# EAGLE design Groupe_5_Azzouz_Berger_Bilongo (EAGLE 8.3.1)
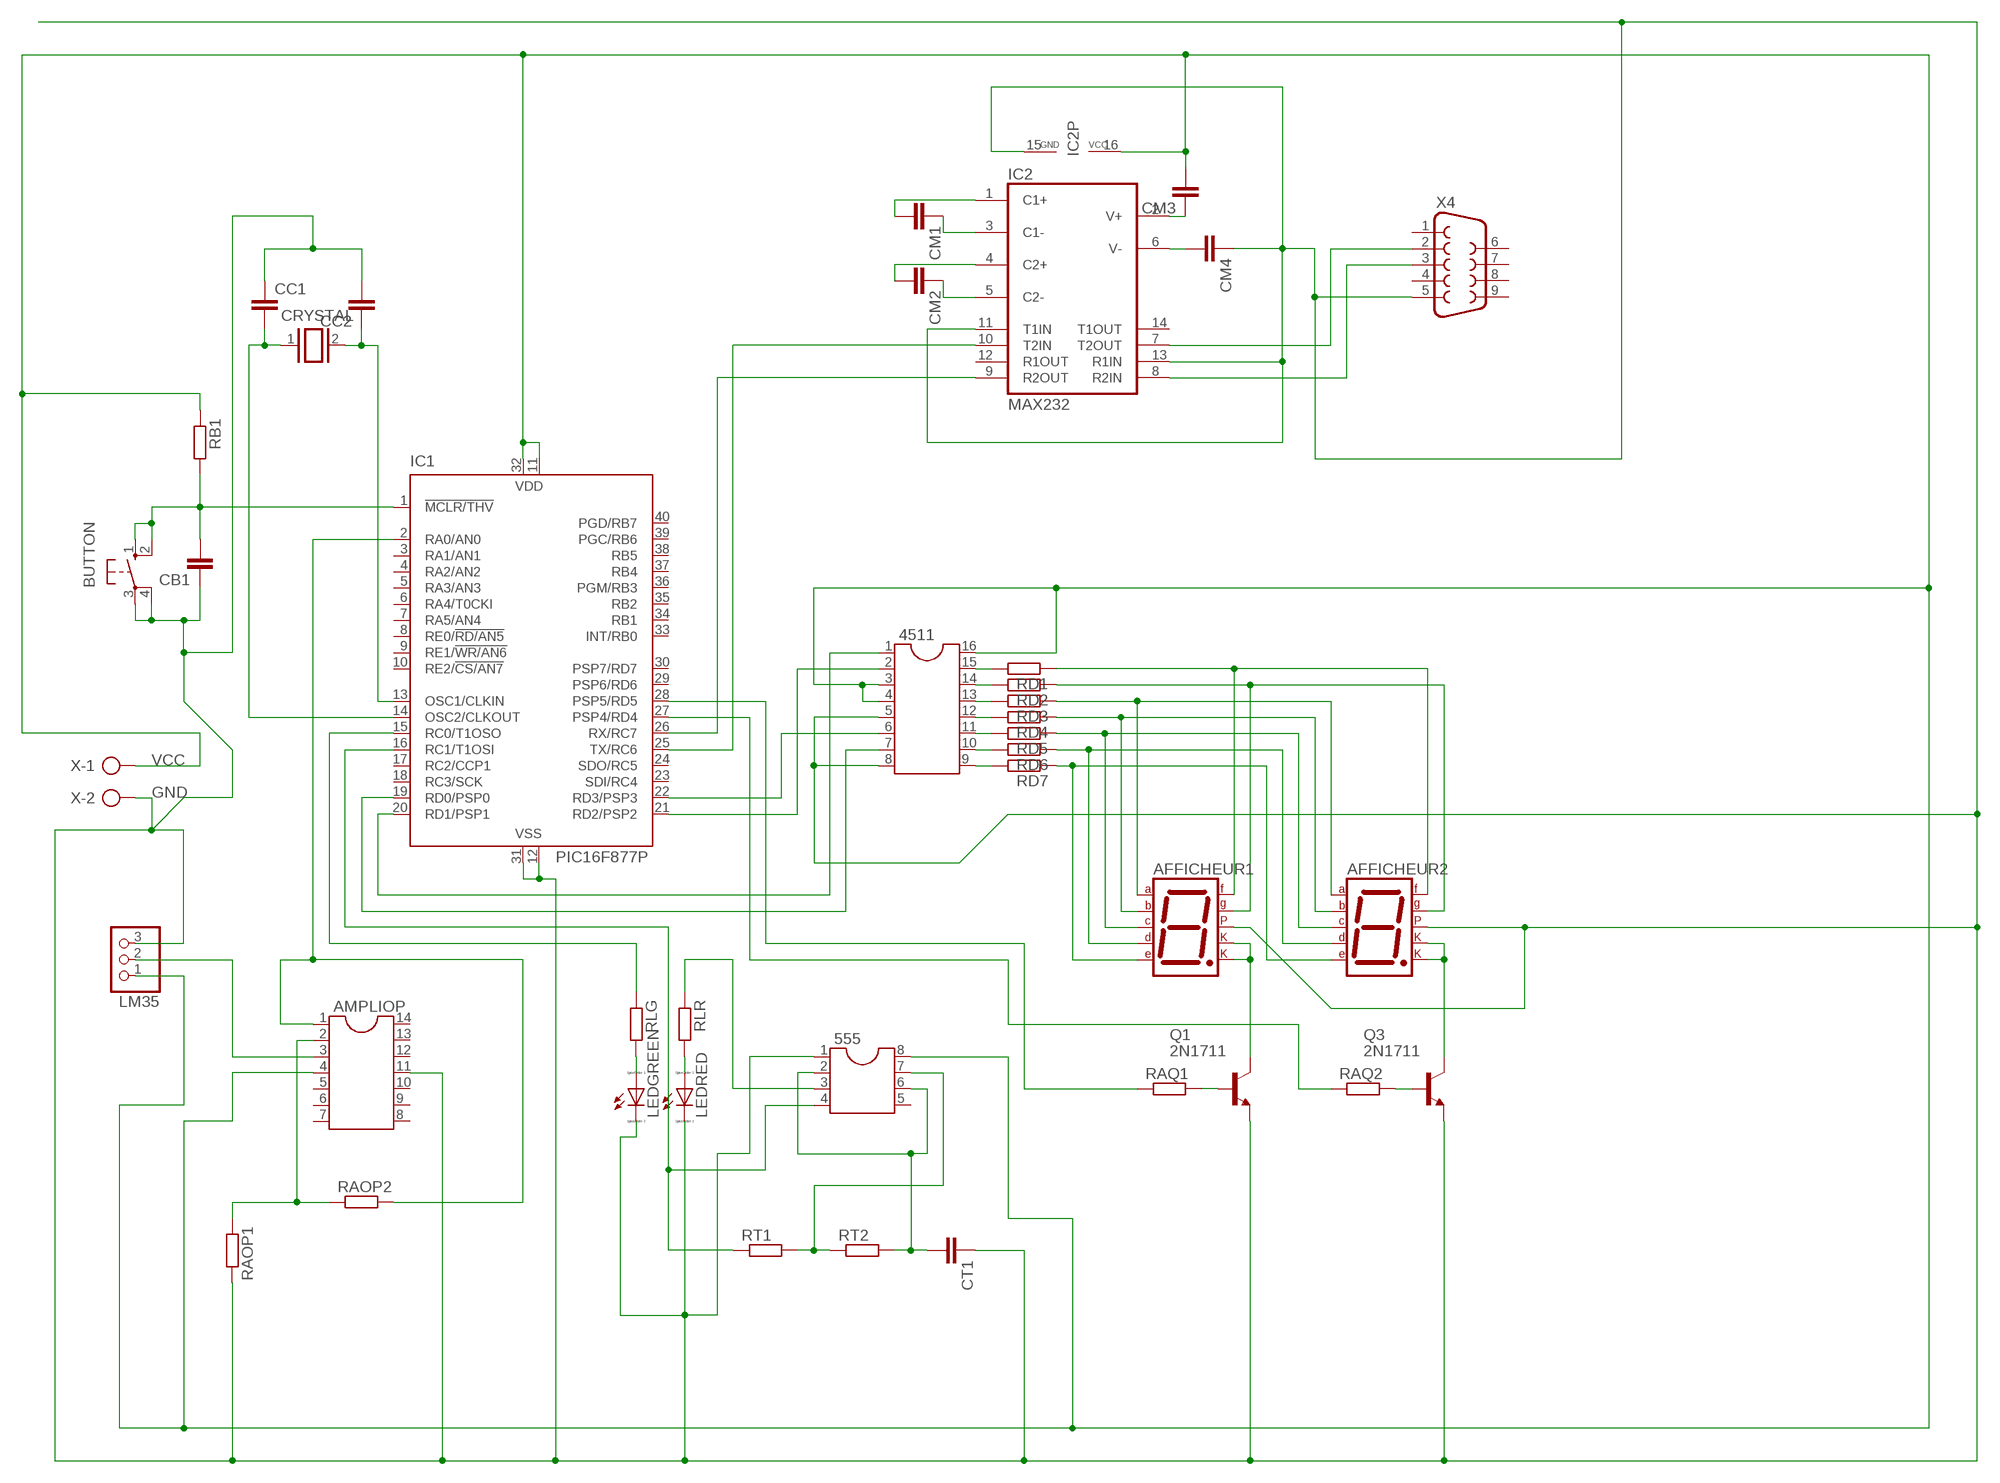
[diagram p0: schematic, sheet 1]

## Parts
555  DIL8  [DIL08]
4511  DIL16  [DIL16]
AFFICHEUR1  7SEG-CK  [7SEG-13]
AFFICHEUR2  7SEG-CK  [7SEG-13]
AMPLIOP  DIL14  [DIL14]
BUTTON  10-XX  [B3F-10XX]
CB1  C-EU025-050X050  [C025-050X050]
CC1  C-EU025-050X050  [C025-050X050]
CC2  C-EU025-050X050  [C025-050X050]
CM1  C-EU025-050X050  [C025-050X050]
CM2  C-EU025-050X050  [C025-050X050]
CM3  C-EU025-050X050  [C025-050X050]
CM4  C-EU025-050X050  [C025-050X050]
CRYSTAL  XTAL/S  [QS]
CT1  C-EU025-050X050  [C025-050X050]
IC1  PIC16F877P  [DIL40]
IC2  MAX232  [DIL16]
LEDGREEN  LED_ELD260  [LED_LD260]
LEDRED  LED_ELD260  [LED_LD260]
LM35  PINHD-1X3  [1X03]
Q1  2N1711  [TO39]
Q3  2N1711  [TO39]
RAOP1  R-EU_0204/7  [0204/7]
RAOP2  R-EU_0204/7  [0204/7]
RAQ1  R-EU_0204/7  [0204/7]
RAQ2  R-EU_0204/7  [0204/7]
RB1  R-EU_0204/7  [0204/7]
RD1  R-EU_0204/7  [0204/7]
RD2  R-EU_0204/7  [0204/7]
RD3  R-EU_0204/7  [0204/7]
RD4  R-EU_0204/7  [0204/7]
RD5  R-EU_0204/7  [0204/7]
RD6  R-EU_0204/7  [0204/7]
RD7  R-EU_0204/7  [0204/7]
RLG  R-EU_0204/7  [0204/7]
RLR  R-EU_0204/7  [0204/7]
RT1  R-EU_0204/7  [0204/7]
RT2  R-EU_0204/7  [0204/7]
X  AK300/2  [AK300/2]
X4  F09V  [F09V]

## Nets
GND: 555.1 4511.5 4511.8 AFFICHEUR1.5(DP) AFFICHEUR2.5(DP) AMPLIOP.11 BUTTON.3(P) BUTTON.4(P1) CB1.1 CC1.1 CC2.2 CM4.1 CT1.1 IC1.12(VSS) IC1.31(VSS) IC2.11(T1IN) IC2.13(R1IN) IC2.15(GND) LEDGREEN.K(C) LEDRED.K(C) LM35.3 Q1.1(E) Q3.1(E) RAOP1.2 X4.5 X.2
N$1: IC1.15(RC0/T1OSO) RLG.1
N$2: LEDGREEN.A RLG.2
N$3: BUTTON.1(S) BUTTON.2(S1) CB1.2 IC1.1(!MCLR/THV) RB1.2
N$4: 555.3 RLR.1
N$5: CC1.2 CRYSTAL.1 IC1.14(OSC2/CLKOUT)
N$6: CC2.1 CRYSTAL.2 IC1.13(OSC1/CLKIN)
N$7: LEDRED.A RLR.2
N$8: AMPLIOP.3 LM35.2
N$9: AMPLIOP.2 RAOP1.1 RAOP2.1
N$10: AMPLIOP.1 IC1.2(RA0/AN0) RAOP2.2
N$11: 555.2 555.6 CT1.2 RT2.2
N$12: 555.7 RT1.2 RT2.1
N$13: 555.4 IC1.16(RC1/T1OSI) RT1.1
N$14: 4511.6 IC1.22(RD3/PSP3)
N$15: 4511.2 IC1.21(RD2/PSP2)
N$16: 4511.15 RD1.2
N$17: 4511.7 IC1.19(RD0/PSP0)
N$18: 4511.1 IC1.20(RD1/PSP1)
N$19: 4511.14 RD2.2
N$20: 4511.13 RD3.2
N$21: 4511.12 RD4.2
N$22: 4511.11 RD5.2
N$23: 4511.10 RD6.2
N$24: 4511.9 RD7.2
N$25: AFFICHEUR1.3(CK1) AFFICHEUR1.8(CK2) Q1.3(C)
N$26: AFFICHEUR2.3(CK1) AFFICHEUR2.8(CK2) Q3.3(C)
N$27: AFFICHEUR1.1(E) AFFICHEUR2.1(E) RD7.1
N$28: AFFICHEUR1.2(D) AFFICHEUR2.2(D) RD6.1
N$29: AFFICHEUR1.4(C) AFFICHEUR2.4(C) RD5.1
N$30: AFFICHEUR1.6(B) AFFICHEUR2.6(B) RD4.1
N$31: AFFICHEUR1.7(A) AFFICHEUR2.7(A) RD3.1
N$32: AFFICHEUR1.10(G) AFFICHEUR2.10(G) RD2.1
N$33: AFFICHEUR1.9(F) AFFICHEUR2.9(F) RD1.1
N$34: Q1.2(B) RAQ1.2
N$35: Q3.2(B) RAQ2.2
N$36: IC1.28(PSP5/RD5) RAQ1.1
N$37: IC1.27(PSP4/RD4) RAQ2.1
N$38: CM3.1 IC2.2(V+)
N$39: CM1.2 IC2.1(C1+)
N$40: CM1.1 IC2.3(C1-)
N$41: CM2.2 IC2.4(C2+)
N$42: CM2.1 IC2.5(C2-)
N$43: CM4.2 IC2.6(V-)
N$44: IC1.25(TX/RC6) IC2.10(T2IN)
N$45: IC1.26(RX/RC7) IC2.9(R2OUT)
N$46: IC2.8(R2IN) X4.3
N$48: IC2.7(T2OUT) X4.2
VCC: 555.8 4511.3 4511.4 4511.16 AMPLIOP.4 CM3.2 IC1.11(VDD) IC1.32(VDD) IC2.16(VCC) LM35.1 RB1.1 X.1
Unconnected: 555.5 AMPLIOP.5 AMPLIOP.6 AMPLIOP.7 AMPLIOP.8 AMPLIOP.9 AMPLIOP.10 AMPLIOP.12 AMPLIOP.13 AMPLIOP.14 IC1.3(RA1/AN1) IC1.4(RA2/AN2) IC1.5(RA3/AN3) IC1.6(RA4/T0CKI) IC1.7(RA5/AN4) IC1.8(RE0/!RD/AN5) IC1.9(RE1/!WR/AN6) IC1.10(RE2/!CS/AN7) IC1.17(RC2/CCP1) IC1.18(RC3/SCK) IC1.23(SDI/RC4) IC1.24(SDO/RC5) IC1.29(PSP6/RD6) IC1.30(PSP7/RD7) IC1.33(INT/RB0) IC1.34(RB1) IC1.35(RB2) IC1.36(PGM/RB3) IC1.37(RB4) IC1.38(RB5) IC1.39(PGC/RB6) IC1.40(PGD/RB7) IC2.12(R1OUT) IC2.14(T1OUT) X4.1 X4.4 X4.6 X4.7 X4.8 X4.9

## Library data of the parts
555 = ic-package:DIL8: Dual In Line / Socket
4511 = ic-package:DIL16: Dual In Line / Socket
AFFICHEUR1 AFFICHEUR2 = special:7SEG-CK: 7-segment DISPLAY single cathode, 13 mm
AMPLIOP = ic-package:DIL14: Dual In Line / Socket
BUTTON = switch-omron:10-XX: OMRON SWITCH; MPN: B3F-1000; OC_FARNELL: 176432; OC_NEWARK: 36M3542
CB1 CC1 CC2 CM1-CM4 CT1 = rcl:C-EU: CAPACITOR, European symbol
CRYSTAL = special:XTAL/S: CRYSTAL
IC1 = microchip:PIC16F87*: MICROCONTROLLER; MF: MICROCHIP; MPN: PIC16F877-04/P; OC_FARNELL: 9761349; OC_NEWARK: 61K3463
IC2 = maxim:MAX232: RS232 TRANSCEIVER; MF: MAXIM; MPN: MAX232ACPE+; OC_FARNELL: 9723773; OC_NEWARK: 68K4544
LEDGREEN LEDRED = eagle-ltspice:LED_E: LED Source: http://www.osram.convergy.de Source: www.luxeon.com Source: www.kingbright.com; SPICEMODEL: NONE; SPICEPREFIX: D; SPICETYPE: diode
LM35 = pinhead:PINHD-1X3: PIN HEADER
Q1 Q3 = transistor-npn:2N1711: NPN Transistor
RAOP1 RAOP2 RAQ1 RAQ2 RB1 RD1-RD7 RLG RLR RT1 RT2 = rcl:R-EU_: RESISTOR, European symbol
X = con-ptr500:AK300/2: CONNECTOR; OC_FARNELL: unknown; OC_NEWARK: unknown
X4 = con-subd:F09: SUB-D; OC_FARNELL: unknown; OC_NEWARK: unknown

## Board
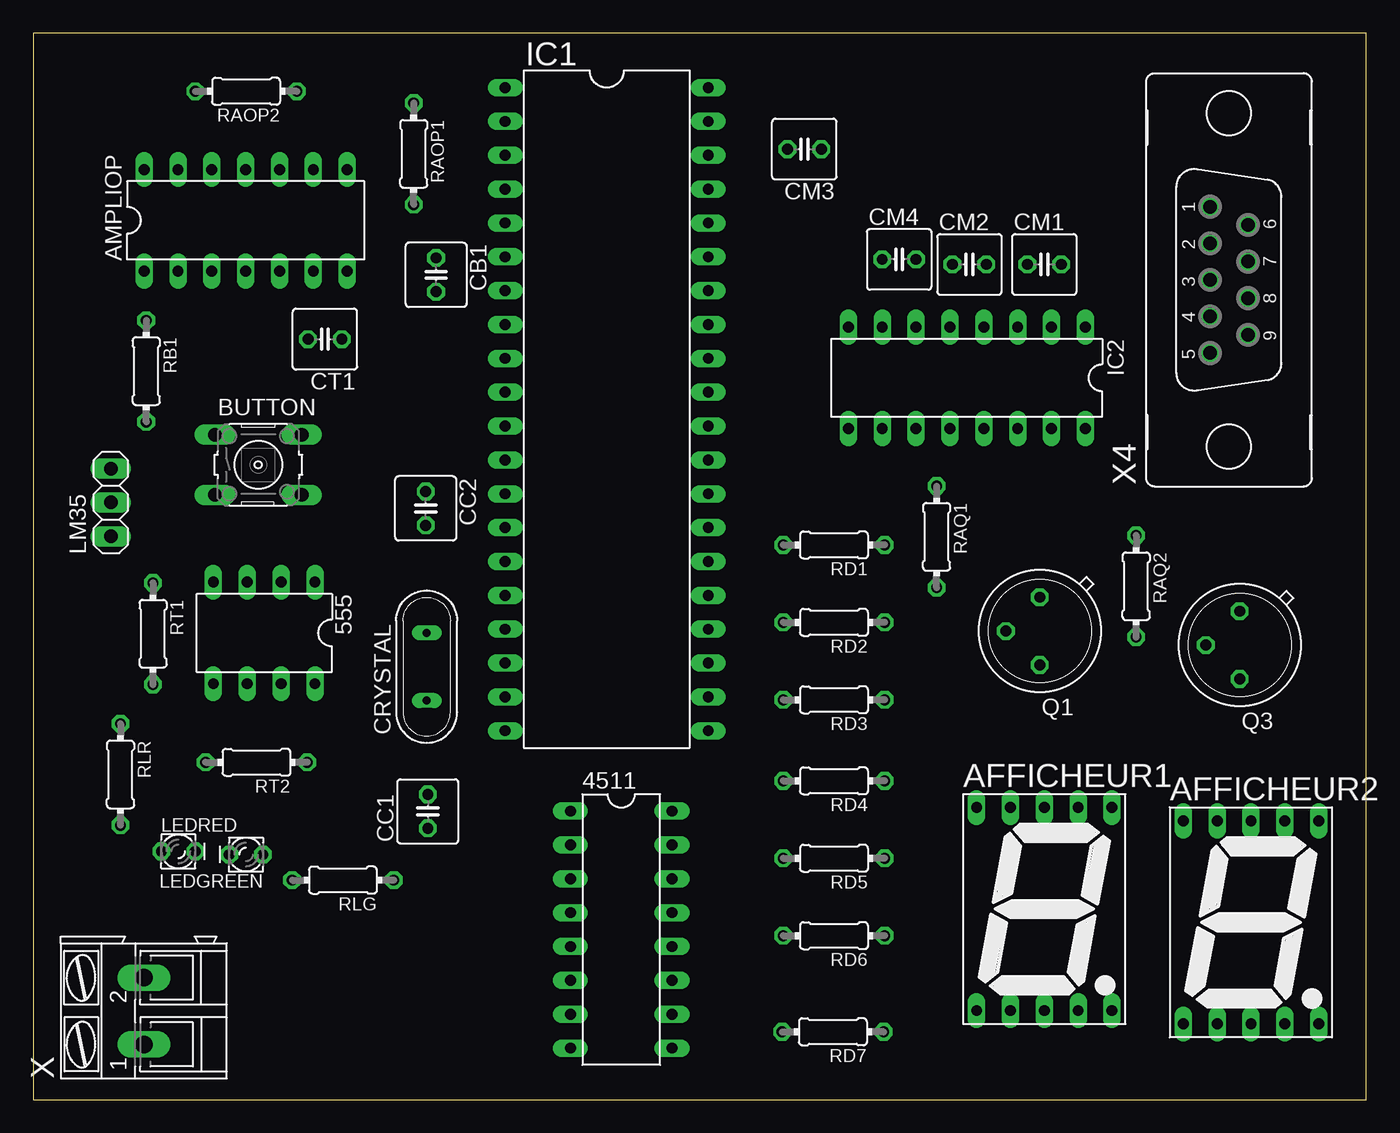
[diagram p1: board, top side]
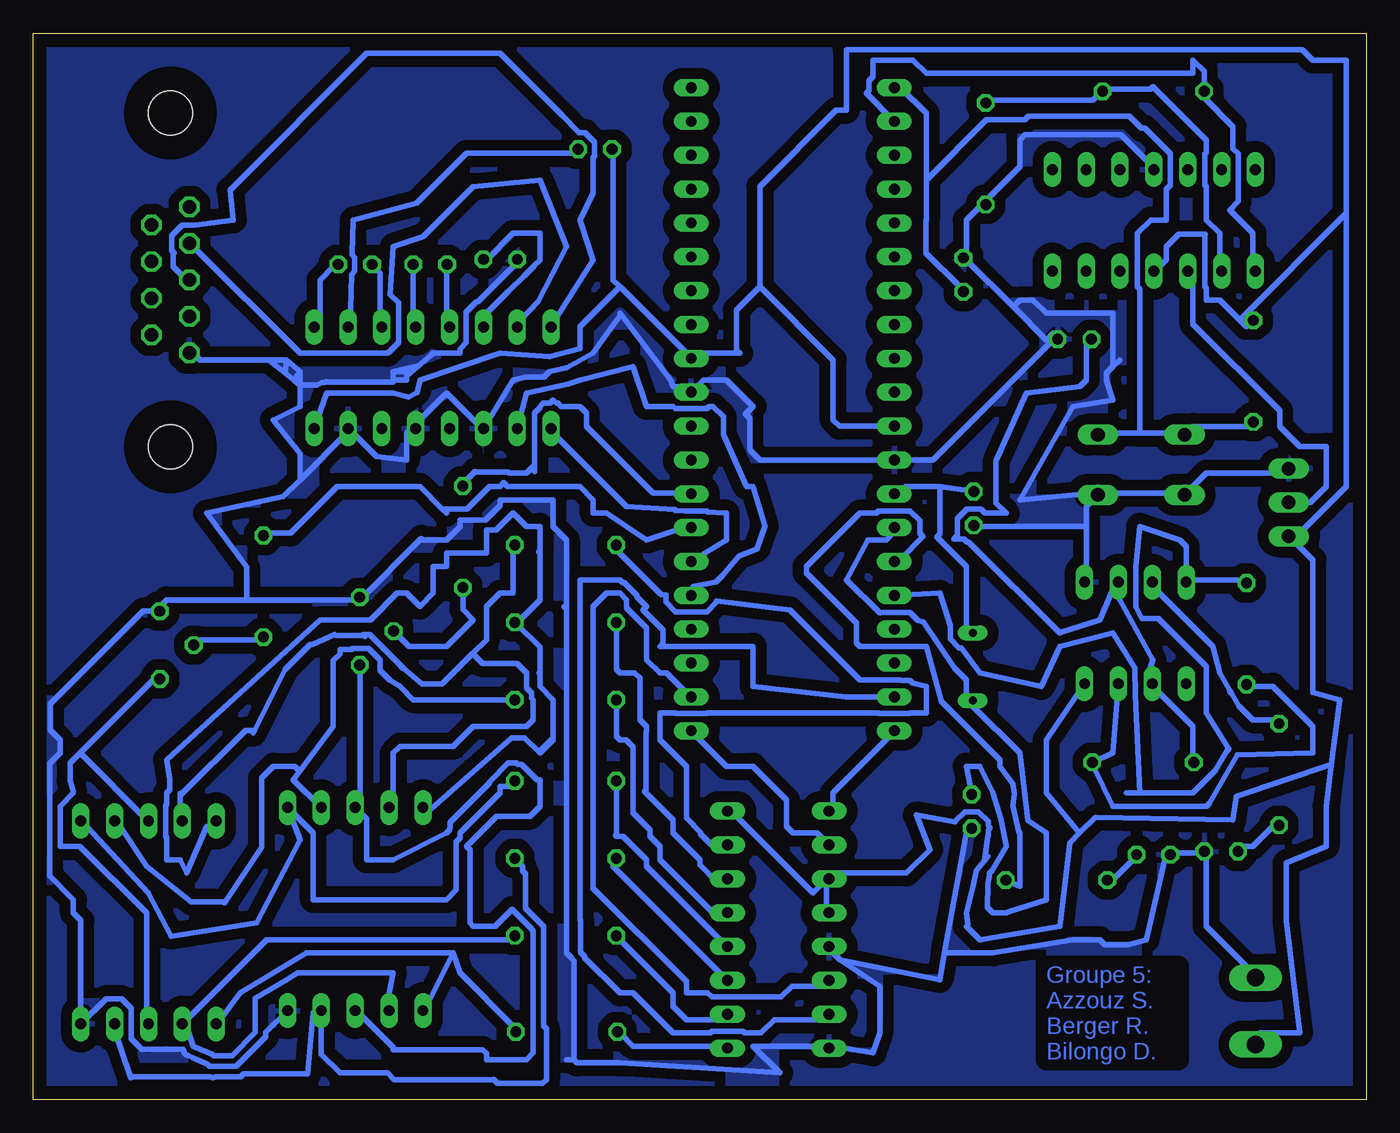
[diagram p2: board, bottom side, seen from below]

Size 100 x 80 mm. Coordinates in mm from the lower left corner, seen from the top.
Outline: 0,0 100,0 100,80 0,80 0,0
Copper layers (1*16): Top 0.035mm / dielectric 1.5mm / Bottom 0.035mm
Design rules "default *": minimum track width 15mil, minimum drill 0.35mm, track to track 15mil, track to pad 15mil, pad to pad 15mil, via to via 15mil, smd to smd 15mil, copper to edge 40mil, drill to drill 6mil, minimum pad ring 10mil, minimum via ring 8mil, stop-mask expansion 4mil, vias tented up to drill 0mil, thermal gap 10mil

### Footprints (pad centres in the part's own frame; a part is rotated, then mirrored left to right if it is on the bottom)
DIL08 = drill 0.813 long: 1 -3.81,-3.81; 2 -1.27,-3.81; 3 1.27,-3.81; 4 3.81,-3.81; 5 3.81,3.81; 6 1.27,3.81; 7 -1.27,3.81; 8 -3.81,3.81
DIL16 = drill 0.813 long: 1 -8.89,-3.81; 2 -6.35,-3.81; 3 -3.81,-3.81; 4 -1.27,-3.81; 5 1.27,-3.81; 6 3.81,-3.81; 7 6.35,-3.81; 8 8.89,-3.81; 9 8.89,3.81; 10 6.35,3.81; 11 3.81,3.81; 12 1.27,3.81; 13 -1.27,3.81; 14 -3.81,3.81; 15 -6.35,3.81; 16 -8.89,3.81
7SEG-13 = drill 0.813 long: 1 -5.08,-7.62; 2 -2.54,-7.62; 3 0,-7.62; 4 2.54,-7.62; 5 5.08,-7.62; 6 5.08,7.62; 7 2.54,7.62; 8 0,7.62; 9 -2.54,7.62; 10 -5.08,7.62
DIL14 = drill 0.813 long: 1 -7.62,-3.81; 2 -5.08,-3.81; 3 -2.54,-3.81; 4 0,-3.81; 5 2.54,-3.81; 6 5.08,-3.81; 7 7.62,-3.81; 8 7.62,3.81; 9 5.08,3.81; 10 2.54,3.81; 11 0,3.81; 12 -2.54,3.81; 13 -5.08,3.81; 14 -7.62,3.81
B3F-10XX = drill 1.016 long: 1 -3.251,2.261; 2 3.251,2.261; 3 -3.251,-2.261; 4 3.251,-2.261
C025-050X050 = drill 0.813 octagon: 1 -1.27,0; 2 1.27,0
QS = drill 0.61 long: 1 -2.54,0; 2 2.54,0
DIL40 = drill 0.813 long: 1 -24.13,-7.62; 2 -21.59,-7.62; 3 -19.05,-7.62; 4 -16.51,-7.62; 5 -13.97,-7.62; 6 -11.43,-7.62; 7 -8.89,-7.62; 8 -6.35,-7.62; 9 -3.81,-7.62; 10 -1.27,-7.62; 11 1.27,-7.62; 12 3.81,-7.62; 13 6.35,-7.62; 14 8.89,-7.62; 15 11.43,-7.62; 16 13.97,-7.62; 17 16.51,-7.62; 18 19.05,-7.62; 19 21.59,-7.62; 20 24.13,-7.62; 21 24.13,7.62; 22 21.59,7.62; 23 19.05,7.62; 24 16.51,7.62; 25 13.97,7.62; 26 11.43,7.62; 27 8.89,7.62; 28 6.35,7.62; 29 3.81,7.62; 30 1.27,7.62; 31 -1.27,7.62; 32 -3.81,7.62; 33 -6.35,7.62; 34 -8.89,7.62; 35 -11.43,7.62; 36 -13.97,7.62; 37 -16.51,7.62; 38 -19.05,7.62; 39 -21.59,7.62; 40 -24.13,7.62
LED_LD260 = drill 0.813 octagon: A -1.27,0; K 1.27,0
1X03 = drill 1.016 long: 1 -2.54,0; 2 0,0; 3 2.54,0
TO39 = drill 0.813 octagon: 1 0,-2.54; 2 2.54,0; 3 0,2.54
0204/7 = drill 0.813 octagon: 1 -3.81,0; 2 3.81,0
AK300/2 = drill 1.321 long: 1 -2.515,0; 2 2.489,0
F09V = drill 1.016 octagon: 1 5.486,1.422; 2 2.743,1.422; 3 0,1.422; 4 -2.743,1.422; 5 -5.486,1.422; 6 4.115,-1.422; 7 1.372,-1.422; 8 -1.372,-1.422; 9 -4.115,-1.422 | hole 3.302: -12.522,0; 12.522,0

### Placement (x,y rotation side)
555  17.32,35.01 180 top
4511  44.11,12.75 270 top
AFFICHEUR1  75.85,14.29 0 top
AFFICHEUR2  91.36,13.29 0 top
AMPLIOP  15.93,65.97 0 top
BUTTON  16.88,47.62 0 top
CB1  30.22,61.88 270 top
CC1  29.6,21.62 90 top
CC2  29.44,44.35 270 top
CM1  75.85,62.66 0 top
CM2  70.23,62.66 0 top
CM3  57.85,71.31 180 top
CM4  64.96,63.04 0 top
CRYSTAL  29.51,32.48 90 top
CT1  21.88,57.05 180 top
IC1  43.02,51.8 270 top
IC2  70.04,54.15 180 top
LEDGREEN  15.96,18.38 180 top
LEDRED  10.88,18.62 0 top
LM35  5.81,44.8 90 top
Q1  75.51,35.15 180 top
Q3  90.51,34.1 180 top
RAOP1  28.54,70.96 270 top
RAOP2  15.96,75.65 180 top
RAQ1  67.77,42.22 270 top
RAQ2  82.74,38.51 270 top
RB1  8.47,54.65 270 top
RD1  60.07,41.61 180 top
RD2  60.07,35.8 180 top
RD3  60.07,29.99 180 top
RD4  60.07,23.91 180 top
RD5  60.07,18.1 180 top
RD6  60.07,12.29 180 top
RD7  59.99,5.08 180 top
RLG  23.23,16.46 180 top
RLR  6.54,24.39 270 top
RT1  8.98,34.95 270 top
RT2  16.74,25.3 180 top
X  8.29,6.65 90 top
X4  89.71,61.5 90 top

### Tracks (layer width: path | path; a pad name or v marks a point on that pad's centre or on a via)
GND
  Bottom 0.406: 21,43 21,44.5 20.5,45 BUTTON.4 | 21,43 21,39 555.1 | 21,43 29,43 CC2.2 | BUTTON.4 20,45.5 14,45.5 BUTTON.3 13.5,45.5 12,47 6,47 LM35.3 | 26.49,59.49 24,57 23.5,57.5 CT1.1 23.5,57 32.5,48 35,48 IC1.12 35.5,48 45.5,48 46.25,48.75 46.25,51.1 46.57,51.43 46,52 48,54 49.71,54 IC1.31 51,53.5 52,53.5 52.15,53.95 56,59 56,58.83 58,56 59.96,54.92 61.26,54.62 61.67,54.21 63.07,54.21 64,54 IC2.11 66.5,50.5 69,53 71.5,50.5 | 26.49,59.49 30,63 CB1.1 30,63.5 30,66 29,67 RAOP1.2 28.5,67.5 26,70 26,72 25.6,72.4 18.4,72.4 15.93,69.93 AMPLIOP.11 | 18.5,55.5 19,55 | 19,55 19.5,54.5 19.5,54 19,52.5 22,52 26,45 20.5,45.5 BUTTON.4 | X.2 8.5,9.5 12,13 12,18.5 LEDRED.K 12.5,18.5 14.5,18.5 LEDGREEN.K 15,18.5 16.5,12 17.9,11.62 19.62,11.62 20,12 22,12 28,11 31.57,11 31.63,11.06 | 39.5,10.5 40,11 4511.5 | 39.5,10.5 36.5,8.5 36.5,5 37,3.5 40,4 4511.8 40.5,4 46,4 44,2 56.02,2.75 59.21,2.75 59.42,2.96 | 39.5,10.5 32,9 31.63,11.06 | 31.63,11.06 30,20 CC1.1 | 82.34,55.5 87.5,55.5 88,56 X4.5 | CM4.1 64,63 64,62.5 66.64,59.87 66.75,59.87 67.53,59.09 67.53,56.78 68,56.31 68,56 70,56 70.15,55.87 72,54.26 | 84,37.5 90,37.5 90.5,37 Q3.1 91.77,36.64 98.72,29.69 98.72,27.72 98,27 98,26 98.78,25.22 98.78,16.78 97,15 97,14 96.44,13.44 AFFICHEUR2.5 94.53,7.58 93.38,7.58 92.66,6.85 92.66,4.54 91.88,3.77 88.77,3.77 88.64,3.44 88.62,3.43 88.62,3.41 88.33,3.29 88.06,3.15 86.93,2.65 86.79,2.51 86.57,2.51 86.53,2.49 86.47,2.51 84.77,2.51 82.57,4.71 82.57,5.03 AFFICHEUR1.5 | 84,37.5 76,37.5 Q1.1 75.5,37.5 70.91,42.09 70.81,42 69,42 68,43 68,43.5 66.09,43.5 65,44.59 65,45 61,45 61,43 60,42 60,37 60.18,37 60,36.82 60,11 59.73,10.73
  Bottom 0.406: 71.5,50.5 72,50 72,48 74.25,48.25 76,50 IC2.15 76.5,50 80,46.5 | 71.5,50.5 IC2.13 | 84,37.5 84,39.95 87,44 81.25,45.25 80,46.5 | 80,46.5 80,48.47 82,51 80,52 80,53.61 | 80,53.61 80,54.63 | 60,3 59.42,2.96 | 19,55 19,59 24,59 25,60 25.97,60 26.49,59.49 | 72,54.26 72,54.63 73,54.63 | 72,54.26 72,54 73,54 | 73,54 73,53.81 73.12,53.84 78.03,53.84 78.05,53.85 78.18,53.79 78.33,53.79 78.69,53.61 80,53.61 | 80.15,53.74 80.46,53.98 | 80.15,53.74 80,53.61 | 80.77,54.23 80.46,53.98 | 80.77,54.23 82.34,55.5 | 80,54.63 80.46,53.98 | 82.34,55.5 81,55.5 | 81,55.5 80,54.63 | 81,55.5 81.12,54.51 80.77,54.23 | 80,54.63 80.15,53.74 | 73,54.63 73,54 | 71.06,55.08 73,54.63 | 59.42,2.96 59.42,10.42 59.73,10.73 | 59.63,10.63 59.73,10.73 | 59.73,10.73 | 59.73,10.73 59.74,10.74
  pour Bottom (isolate 0.813, rank 2): 0,0 0,80 100,80 100,0
N$1
  Bottom 0.406: 27.12,16.5 RLG.1 26,16 26,20 26.04,20.06 26.5,22.05 26.41,22.95 26.5,23.67 27.5,25 27.5,25.5 31.88,29.88 33,34 38,34 38.25,34.25 38.25,35.75 42,39.5 42,40 38,44 36.73,44 36.58,44.16 34.22,44.16 33.49,43.43 33.49,42.48 33.26,42.24 35,40.5 IC1.15
N$2
  Bottom 0.406: LEDGREEN.A 17.5,18 19,16.5 RLG.2
N$3
  Bottom 0.406: RB1.2 8.5,50.5 13,50.5 13.5,50 BUTTON.1 14,50 17,50 | 17,50 20,50 BUTTON.2 | CB1.2 30.5,61 33.01,63.51 33.01,65.99 33,66 33,69 | 35,75.5 IC1.1 34.93,75.93 33,74 33,69 | 17,50 17,60.81 17.18,60.98 17.18,65 16.18,66 15,66 15,68.29 14.69,68.6 14.69,70.96 16.59,72.87 16.87,72.87 17.79,73.79 25.33,73.79 25.61,73.5 28.5,73.5 33,69
N$4
  Bottom 0.406: RLR.1 7,28.5 8.5,28.5 9.54,29.54 10.12,30.52 10.22,30.62 10.22,30.69 11,32 11.5,34 16,38.5 555.3
N$5
  Bottom 0.406: IC1.14 35.5,42.5 36,42 37.39,42 39,39 36.5,36.5 36.21,36.56 36.11,36.53 34.22,36.53 33.64,35.95 33.22,35.85 30.88,32.38 30,31.5 30,30 CRYSTAL.1 29.5,29.5 26,26 25.37,20.95 24,20 24,15 26.73,14.14 27,14 28,14 28.43,14.43 28.4,16.2 28.35,16.42 28.29,16.78 28.29,16.98 28.09,17.17 27,19 27.39,21.04 | 27.39,21.04 | 27.39,21.04 28,23 29,25 30,25 CC1.2
N$6
  Bottom 0.406: CRYSTAL.2 30,35.5 30,40 32.21,42.21 32,42.42 32,46 | 35.28,45.31 35,45 | 35.28,45.31 IC1.13 | 32,46 29.63,45.65 CC2.1 | 32,46 34.59,46 35.28,45.31
N$7
  Bottom 0.406: LEDRED.A 9.5,19 8.5,19 7,20.5 RLR.2
N$8
  Bottom 0.406: AMPLIOP.3 13,62 13,58.19 6.5,51.69 6.5,50.5 5,49 3,49 3,46 4.2,44.8 LM35.2
N$9
  Bottom 0.406: AMPLIOP.2 11,62.5 11,65 12,66 12,68.51 12.1,68.6 12.1,70.96 12,71.05 12,72 16,76 16.21,75.79 19.66,75.79 RAOP2.1 20,75.5 20.5,75 28.5,75 RAOP1.1
N$10
  Bottom 0.406: AMPLIOP.1 8.5,62.5 8.5,65 10.25,66.75 9.61,67.39 9.61,70.96 10,71.35 10,73 12.15,75.15 RAOP2.2 12.15,77.14 13,77.99 13,77 33,77 33.99,77.99 37,77.99 37,76.75 37.3,76.45 37.3,75.69 37.5,75.5 35.5,73.5 IC1.2
N$11
  Bottom 0.406: RT2.2 13,25.5 13,28 16,31 555.6 16.5,31.5 16,33 18.5,37.5 555.2 18.75,38.89 20,36 22.95,35.05 23,35 29.84,41.84 29.96,41.84 30.18,42.06 30.94,42.06 30.68,42.31 30.68,43.6 29.96,44.33 28.92,44.33 28.6,44 27,44 27.77,44.77 27.77,47.9 25.5,53 21.5,53.5 21,54 21,57 CT1.2
N$12
  Bottom 0.406: RT1.2 8.5,31 7,31 4,28 4,26 9.67,25.85 11.77,22.23 12,22 19,22 20.52,25.09 RT2.1 19,26 555.7
N$13
  Bottom 0.406: 9,38.88 RT1.1 9,39 13.5,39 555.4 | 13.5,38.88 555.4 | 17,23 17.3,30.3 17.34,32.37 17.34,32.38 17.35,32.38 19,35 23,34 24.38,30.98 29,32 30.38,33.88 30.54,33.88 31.21,34.55 31.21,35.49 31.18,35.53 32,38 IC1.16 | 17,23 13,23 11.32,24.68 10.46,26.16 10.32,26.3 12,29 12,32.5 15.6,36.1 16.82,36.1 17.3,36.95 17.3,40 17.29,40 17.29,40.03 17,43 14,42 13.51,41.51 555.4 | 17,23 18,23
N$14
  Bottom 0.406: 4511.6 40.5,8.5 43.09,8.5 43.89,7.7 49.1,7.7 49.4,8 51,8 51,8.85 58,15.85 58,37 57,38 56,38 55.5,37.5 55.5,36.89 54,35.39 54,33 53,32 52.5,32 51,30.5 IC1.22
N$15
  Bottom 0.406: IC1.21 50.64,27.64 48,25 46,25 43.5,22.5 43.5,20.5 43,20 41.2,20 4511.2
N$16
  Bottom 0.406: RD1.2 56.5,41.5 52.9,37.9 52.55,37.85 52.55,37.31 51.82,36.59 49.46,36.59 48.73,37.31 48.73,37.4 43.25,36.75 38,31.5 35,31.5 34.82,31.45 34.22,31.45 34.03,31.26 33,31 33,29 34.19,29 34.22,28.96 36.58,28.96 36.61,29 49.43,29 49.46,28.96 51.82,28.96 51.85,29 53,29 53,27 51,25 51,21.11 49.94,20.06 49.94,19.94 49,19 48.02,19 4511.15
N$17
  Bottom 0.406: 4511.7 40.5,6 44.39,6 45.39,5 46.64,5 46.74,5.11 49.1,5.11 49.2,5 52,5 55,8 56,8 58.64,10.64 58.64,10.75 58.94,11.06 58.94,13.44 59,13.5 59,39 56,39 55.79,38.79 55.67,38.79 54.71,37.83 54.71,37.71 54,37 54.25,36.75 52.75,35.25 52.75,34.25 53,34 46,34 46,31 39.01,30.22 IC1.19
N$18
  Bottom 0.406: 4511.1 40,22 40,23 35.5,27.5 IC1.20
N$19
  Bottom 0.406: RD2.2 56.26,32.26 56,32 54.88,32 54.5,31.62 54.5,28.5 54,28 54,27.61 54.04,27.58 54.04,23.23 54.13,23.13 52,21 52,20 50,18 50,17.61 48.69,16.31 48.17,16.31 4511.14
N$20
  Bottom 0.406: RD3.2 56.26,27.26 56,27 55.53,27 55,26.47 55,21.5 53.75,20.25 53.75,19.75 53,19 53,18 49,14 47.94,14 4511.13
N$21
  Bottom 0.406: 4511.12 48,11.5 54,17.5 54,18 55.75,19.75 56.25,19.75 56.3,19.8 56.26,19.84 RD4.2
N$22
  Bottom 0.406: 4511.11 48,9 56.5,17.5 56,18 RD5.2
N$23
  Bottom 0.406: RD6.2 56.26,12.26 52,8 52,7 51,6 48.57,6 48.04,6.52 4511.10
N$24
  Bottom 0.406: 4511.9 48,4 55,4 56,5 RD7.2
N$25
  Bottom 0.406: Q1.3 75.5,32.5 75.5,22 AFFICHEUR1.8 75,21.06 75,18 73,18 69,20 68.79,20.21 68.79,20.33 68.75,20.36 68.75,20.79 65.79,23.75 65.79,23.83 64.36,25.25 63.75,25.25 63.66,25.16 63.36,25.16 62.21,24 62,24 62,22 62.75,21.25 65.25,21.25 67.5,19 67.25,18.75 67.25,13.25 67,13 65.35,13 64.09,14.26 62.63,12.81 62.63,12.77 62.5,12.64 62.5,3.5 63,3 66,3 66,3.46 66.29,3.75 73,3.75 73,3.91 75.68,6.59 AFFICHEUR1.3
N$26
  Bottom 0.406: 96.5,26 91,31.5 Q3.3 | 96.5,26 97.25,25.25 97.25,23.91 97,23.16 97,23 97.99,22.01 97.99,19.01 96.96,19.01 96.96,19 96.5,19 91.5,14 91.5,6 AFFICHEUR2.3 | 96.5,26 91.5,21 AFFICHEUR2.8
N$27
  Bottom 0.406: 68.5,11 70.5,7 AFFICHEUR1.1 | 68.5,11 68,9.5 64,5.5 RD7.1 | 68.5,11 79.5,11 84.5,8 86,6 AFFICHEUR2.1
N$28
  Bottom 0.406: RD6.1 64,12 82.5,12 88.5,6 AFFICHEUR2.2 88.5,5.5 88,4 86.51,3.34 86.46,3.3 85.1,3.3 83.36,5.04 | AFFICHEUR1.2 73.5,7 73,9.5 80.17,9.5 81,9 83.36,7.58 83.36,5.41 | 83.36,5.41 83.36,5.04 | 83.36,5.04 83.36,5.41
N$29
  Bottom 0.406: AFFICHEUR2.4 94,5.5 92.71,1.63 92.61,1.72 86.74,1.72 86.55,1.64 | 63.5,18 RD5.1 63.29,17.51 63.29,17.17 63.06,16.94 63.06,14.34 61.71,13 61.71,5.53 61.5,5.31 61.5,1.5 61.78,1.22 65.18,1.22 65.48,1.52 65.5,1.5 72.93,1.5 73.43,2 77,2 78.39,3.39 AFFICHEUR1.4 78.5,6.5 79,6.5 79.41,1.95 84.22,1.95 84.45,1.72 86.33,1.72 86.55,1.64 | 86.55,1.64 | 86.55,1.64
N$30
  Bottom 0.406: RD4.1 64,23.5 65,23.5 65,23 68,20 68,19.61 68.29,19.33 68.29,15.71 69,15 79,15 79,20 80.5,21.5 AFFICHEUR1.6 80,19.5 83.25,13.25 89.67,12.25 91.4,15.52 96,20.5 AFFICHEUR2.6
N$31
  Bottom 0.406: AFFICHEUR1.7 78.5,22 80.5,24 80.03,24.63 | AFFICHEUR2.7 93.5,20.5 91.5,17.5 88.15,14.82 85.72,14.82 85.66,14.76 82.89,18.92 82.89,24.11 82,25 80.4,25 80.03,24.63 | 80.03,24.63 77.5,28 77.5,32.95 77,33.45 77,33.78 76.1,33.78 76.03,33.85 74.86,33.85 74,33 74,32.19 73.28,31.47 72.5,31 71.5,30 64,30 RD3.1
N$32
  Bottom 0.406: 63.73,35.68 63.5,35.5 | 63.73,35.68 RD2.1 63.5,36 62,37.5 62,41 62.1,41.1 62,41.2 62,43 63,43 64,44 65.29,42.71 66,42.71 66,41 69,41 69,40.05 69.05,40 70,40 70,38 71,37 72,38 72.69,38 74.69,36 78.5,36 90,25.5 89.76,24.04 89.76,23.24 90,23 90,22.15 90.06,22.09 90.06,19.73 90,19.67 90,18 89,18 88.5,17 87,20.5 86.5,20.5 AFFICHEUR2.10 | AFFICHEUR1.10 70.5,21.5 64.12,27.13 63.13,27.13 62,26 | 62,26 62,26.14 61,27.14 | 62.06,32 62,31.93 | 62,31.93 62,31 61,30 61,27.14 | 62,31.93 62,33.95 63.73,35.68 | 61,27.14 61,27 62,26
N$33
  Bottom 0.406: RD1.1 64,41.5 64,38 65,38 66,37 66,34.5 67.05,33.45 | 83.4,27.7 81.12,32.25 79.24,34.14 79.06,34.14 77.38,34.89 77.29,34.8 75.16,34.8 75.11,34.76 75.25,34.9 74.77,34.9 72.22,32.35 72.26,32.35 72.45,32.54 70.84,31.2 69.36,31.2 69.33,31.17 67.05,33.45 | 83.4,27.7 83.5,27.5 | AFFICHEUR1.9 73,22.22 73,26 72.5,26.5 68.5,26.5 67,28 63,28 62.5,28.5 62.5,30 62.63,30.14 62.63,30.51 63,30.87 63,32 63.7,32.7 66.3,32.7 67.05,33.45 | AFFICHEUR2.9 88.97,21.06 88.97,22.97 88.89,22.89 84.08,27.7 83.4,27.7
N$34
  Bottom 0.406: RAQ1.2 67.77,36.77 67,36 69,34 71.82,34 Q1.2
N$35
  Bottom 0.406: RAQ2.2 83,34.5 87.5,34.5 Q3.2
N$36
  Bottom 0.406: IC1.28 51,45.5 53.5,45.5 58.5,50.5 58.5,51.5 59,52 60.39,52 60.63,52.24 60.74,52.24 61,52.5 61.25,52.25 61.75,52.25 62,52 62,51.91 62.4,51.52 62.4,48 | RAQ1.1 67.5,46.5 66.86,47.14 66.8,47.07 64.39,47.07 64.31,47 63,47 62.4,47.6 | 62.4,48 62.4,47.6 | 62.4,47.41 62.4,47.1 | 62.4,47.41 62.4,47.6 | 62.4,48 62.4,47.41
N$37
  Bottom 0.406: RAQ2.1 82.5,42.5 80.69,42.5 77.19,46 71,46 69.32,44.32 | IC1.27 50.96,42.99 54,42 57,44 58,44 58,45 59,46 64.43,46 64.71,46.29 65,46 65.78,46 67.46,44.32 69.32,44.32 | 69.32,44.32 69,44
N$38
  Bottom 0.406: CM3.1 59.5,71 67.5,71 71.25,67.25 76,66 76.08,63.38 75.88,63.18 75.88,62.14 76.12,61.9 76.24,57.98 IC2.2
N$39
  Bottom 0.406: IC2.1 78.5,58 78.5,61.5 77.5,62.5 CM1.2
N$40
  Bottom 0.406: IC2.3 74,58 74,62 74.5,62.5 CM1.1
N$41
  Bottom 0.406: CM2.2 71.5,58 IC2.4
N$42
  Bottom 0.406: IC2.5 69,58 69,62.5 CM2.1
N$43
  Bottom 0.406: IC2.6 66,58 66,59 64.33,60.67 63.18,61.8 63.17,61.8 62.45,62.52 62.45,62.55 62,63 62,65 64,65 66,63 CM4.2
N$44
  Bottom 0.406: IC1.25 50.5,38 50.5,38.5 48.77,38.85 48.31,39.31 47.06,40.78 45.72,41.31 45.09,43.02 46,46 46.5,46 48.23,49.9 48.23,51.23 49,52 49.29,52 49.46,51.83 51.82,51.83 51.99,52 54,52 55,55 59,54 59.9,53.7 63,53 IC2.10
N$45
  Bottom 0.406: IC2.9 61,50 55.5,44.5 51.87,44.26 51.82,44.2 51.05,44.16 49.46,44.16 49.4,44.09 48.12,44.01 48,44 48,42 IC1.26
N$46
  Bottom 0.406: IC2.8 61,58 61,58.25 58,63 59,66 58,68 58,70.67 57.88,70.79 57.88,71.83 58.6,72.56 59.04,72.56 60.35,73.85 65,78.5 75,78.5 85.25,68.25 85,66 87.87,65.59 88.84,65.59 89.63,64.8 89.63,63.69 89.44,63.49 89.5,63.36 89.5,62.5 88.5,61.5 X4.3
N$47
  pour Bottom (isolate 0.813): 0,0 0,80 100,80 100,0
N$48
  Bottom 0.406: IC2.7 63.5,58 63.5,58.46 62.14,59.86 60,64 62,69 67,68.5 70.75,64.75 73,64 73.21,60.39 72.61,59.78 72.61,56.78 73.33,56.05 73.47,56.05 73.47,56 80,56 88,64 X4.2
VCC
  Bottom 0.406: 45.5,61 47.25,59.25 47.25,56.25 47,56 50.25,56 IC1.32 51,56 56,61 | 56,61 56.5,61.5 56.5,71 CM3.2 | 40.5,16.5 40.5,14.5 4511.4 | 40.5,16.5 41.5,15.5 47.5,21.5 4511.16 | 40.5,16.5 4511.3 40,17 34.5,17 32.75,18.75 33.75,21.34 30.84,20.85 30.84,20.87 30.12,21.59 29.08,21.59 28.36,20.87 28.36,20.58 28.24,20.41 28.36,20.15 | 5.5,42 4,40.5 4,30.56 2,30 2.6,25.16 | 5.5,42 LM35.1 | 9.5,58.5 9,58 8.5,58.5 RB1.1 | 9.5,58.5 11,60 12,60 12,60.89 12.1,60.98 12.1,64.91 12.06,64.94 14.06,64.94 15,64 15,63.03 15.64,62.38 AMPLIOP.4 | X.1 8,4.5 8,5 5,5 6,13.41 6,17.74 3,19 3,22 2.6,25.16 | 21.51,19.99 20.33,21.17 10,21 9.75,22.75 2.6,25.16 | 21.51,19.99 22.25,19.25 23,13 29,12 30,13 29.88,13.15 30,14 29.48,16.1 29.26,17.2 28.64,17.92 | 45.5,61 45.5,68.5 39.77,74.23 39,74.23 39,78.78 4.78,78.78 4,78 1.5,78 1.5,66.5 | 9.5,58.5 1.5,66.5 | 56,61 59,58 59,56.35 61.27,55.73 65,56 71,54 71.22,53.05 71.83,52.7 73,53 78,53 IC2.16 | 555.8 24,27 24,23 23.1,21.92 21.51,19.99 | 28.36,20.21 28.36,20.15 | 28.64,17.92 28.38,18.23 | 28.36,20.13 28.36,20.15 | 28.35,20.16 28.36,20.13 | 28.36,20.13 28.36,19.83 28.4,19.79 28.64,17.92 | 1.5,66.5 1.5,46 5.5,42 | IC1.11 39.53,50.53 40,51 40,55.5 45.5,61

### Text on the board
Bottom: Groupe 5: / Azzouz S. / Berger R. / Bilongo D.